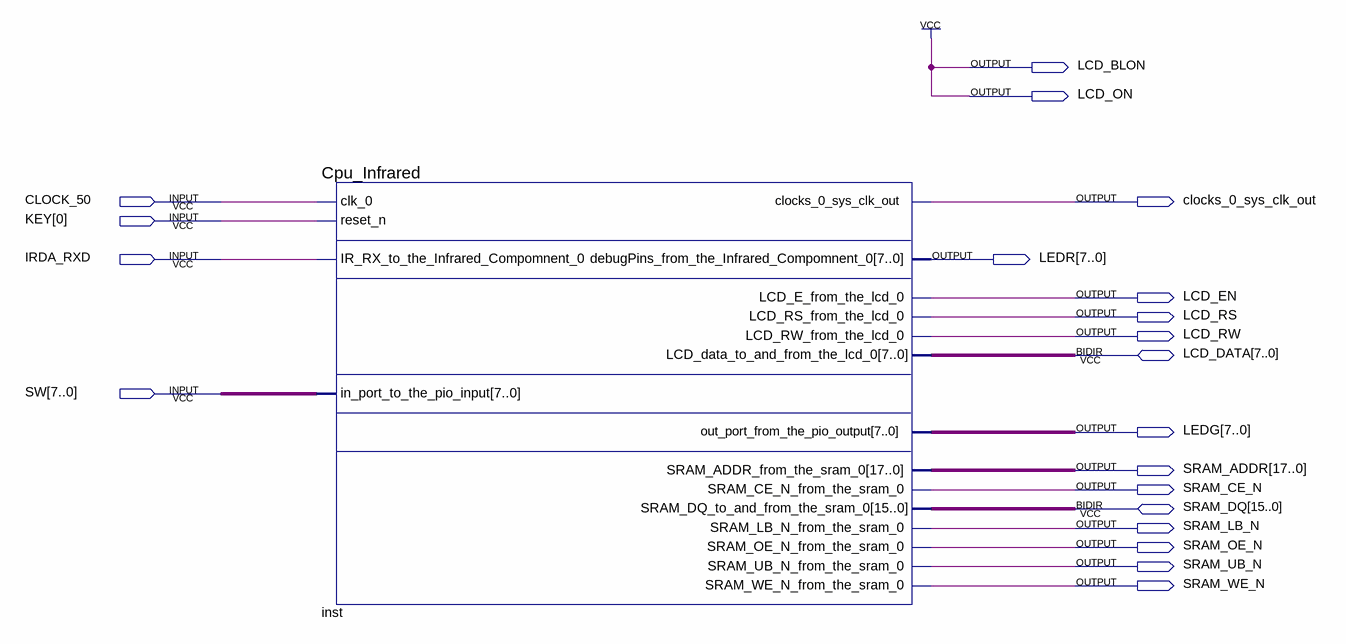
[diagram p0: schematic sheet]
// Quartus schematic DSPC_InfraRead_toplevel.bdf as structural Verilog: 1 symbols, 20 pins
module DSPC_InfraRead_toplevel (
  input  CLOCK_50,
  input  [0:0] KEY,
  input  IRDA_RXD,
  input  [7:0] SW,
  inout  [7:0] LCD_DATA,
  inout  [15:0] SRAM_DQ,
  output LCD_BLON,
  output LCD_ON,
  output clocks_0_sys_clk_out,
  output [7:0] LEDR,
  output LCD_EN,
  output LCD_RS,
  output LCD_RW,
  output [7:0] LEDG,
  output [17:0] SRAM_ADDR,
  output SRAM_CE_N,
  output SRAM_LB_N,
  output SRAM_OE_N,
  output SRAM_UB_N,
  output SRAM_WE_N
);

  Cpu_Infrared inst (
    .clk_0(CLOCK_50), .reset_n(KEY[0]), .IR_RX_to_the_Infrared_Compomnent_0(IRDA_RXD),
    .in_port_to_the_pio_input(SW), .clocks_0_sys_clk_out(clocks_0_sys_clk_out),
    .debugPins_from_the_Infrared_Compomnent_0(LEDR), .LCD_E_from_the_lcd_0(LCD_EN),
    .LCD_RS_from_the_lcd_0(LCD_RS), .LCD_RW_from_the_lcd_0(LCD_RW), .out_port_from_the_pio_output(LEDG),
    .SRAM_ADDR_from_the_sram_0(SRAM_ADDR), .SRAM_CE_N_from_the_sram_0(SRAM_CE_N),
    .SRAM_LB_N_from_the_sram_0(SRAM_LB_N), .SRAM_OE_N_from_the_sram_0(SRAM_OE_N),
    .SRAM_UB_N_from_the_sram_0(SRAM_UB_N), .SRAM_WE_N_from_the_sram_0(SRAM_WE_N),
    .LCD_data_to_and_from_the_lcd_0(LCD_DATA), .SRAM_DQ_to_and_from_the_sram_0(SRAM_DQ));

  assign LCD_BLON = 1'b1;
  assign LCD_ON = 1'b1;
endmodule
